# Altium schematic sheet Main.SchDoc
size A4; SheetNumber: 1; SheetTotal: 4
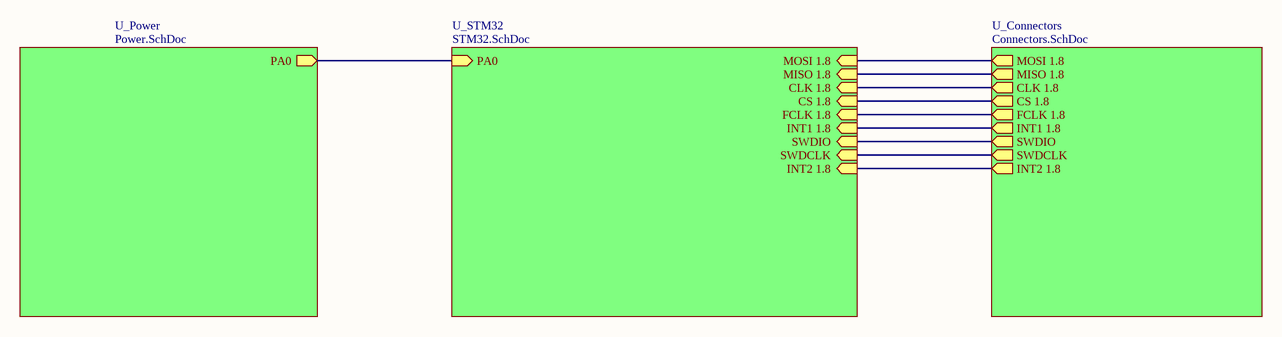
[diagram p0: Main.SchDoc]

## Sub-sheets
U_Connectors = Connectors.SchDoc: MISO 1.8 (out), MOSI 1.8 (out), CLK 1.8 (out), CS 1.8 (out), FCLK 1.8 (out), INT1 1.8 (out), SWDIO (out), SWDCLK (out), INT2 1.8 (out)
U_Power = Power.SchDoc: PA0 (out)
U_STM32 = STM32.SchDoc: MOSI 1.8 (in), MISO 1.8 (in), CLK 1.8 (in), CS 1.8 (in), FCLK 1.8 (in), SWDIO (in), SWDCLK (in), INT1 1.8 (in), PA0 (in), INT2 1.8 (in)

## Nets
(unnamed): sheet U_Power/PA0, sheet U_STM32/PA0
(unnamed): sheet U_STM32/MOSI 1.8, sheet U_Connectors/MOSI 1.8
(unnamed): sheet U_STM32/MISO 1.8, sheet U_Connectors/MISO 1.8
(unnamed): sheet U_STM32/CLK 1.8, sheet U_Connectors/CLK 1.8
(unnamed): sheet U_STM32/CS 1.8, sheet U_Connectors/CS 1.8
(unnamed): sheet U_STM32/FCLK 1.8, sheet U_Connectors/FCLK 1.8
(unnamed): sheet U_STM32/SWDIO, sheet U_Connectors/SWDIO
(unnamed): sheet U_STM32/SWDCLK, sheet U_Connectors/SWDCLK
(unnamed): sheet U_STM32/INT1 1.8, sheet U_Connectors/INT1 1.8
(unnamed): sheet U_STM32/INT2 1.8, sheet U_Connectors/INT2 1.8